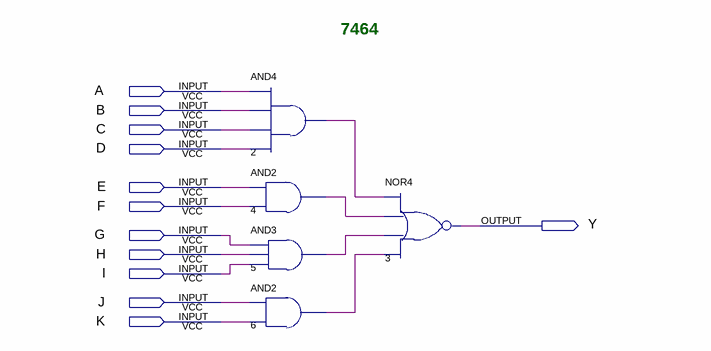
[diagram p0: schematic sheet]
// Quartus schematic 7464.bdf as structural Verilog: 5 symbols, 12 pins
module \7464  (
  input  A,
  input  B,
  input  C,
  input  D,
  input  E,
  input  F,
  input  G,
  input  H,
  input  I,
  input  J,
  input  K,
  output Y
);

  wire n2_out, n4_out, n5_out, n6_out;

  and u_2 (n2_out, A, B, C, D);
  and u_4 (n4_out, E, F);
  and u_5 (n5_out, G, H, I);
  and u_6 (n6_out, J, K);
  nor u_3 (Y, n2_out, n4_out, n5_out, n6_out);

  // Notes on the sheet:
  //   7464
endmodule
